# Altium schematic sheet BMA253_Orientation_Sensor.SchDoc: BMA253 Orientation Sensor
size A4; DocumentNumber: 20; SheetNumber: 20; SheetTotal: 50
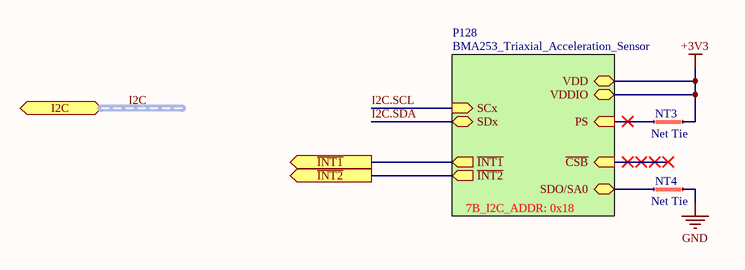
[diagram p0: BMA253_Orientation_Sensor.SchDoc]

## Parts
NT3  Net Tie  [Net Tie 6x30mil]  (net tie, no BOM)
NT4  Net Tie  [Net Tie 6x30mil]  (net tie, no BOM)

## Sub-sheets
P128 = BMA253_Triaxial_Acceleration_Sensor: ~{INT2} (out), ~{INT1} (out), SCx (in), SDO/SA0, ~{CSB} (in), PS (in), SDx (bidir), VDD, VDDIO  | 7B_I2C_ADDR: 0x18

## Ports
I2C (harness I2C), ~{INT1} (out), ~{INT2} (out)

## Nets
+3V3: NT3.2 ; sheet P128/VDD, sheet P128/VDDIO
GND: NT4.2
~{INT1}: port ~{INT1}, sheet P128/~{INT1}
~{INT2}: port ~{INT2}, sheet P128/~{INT2}
I2C.SCL: sheet P128/SCx
I2C.SDA: sheet P128/SDx
NetNT3_1: NT3.1 ; sheet P128/PS
NetNT4_1: NT4.1 ; sheet P128/SDO/SA0

## Buses and harness runs
harness I2C = port I2C

## Notes on the sheet
- Title
- Size:
- Date:
- A4
- Number:
- Time:
- Revision:
- Sheet
- of
- File:

## Library data of the parts
NT3 NT4 = Net Tie Line: ClassName: P128